# EAGLE design Mega328MLF_Programmer (EAGLE 6.6.0)
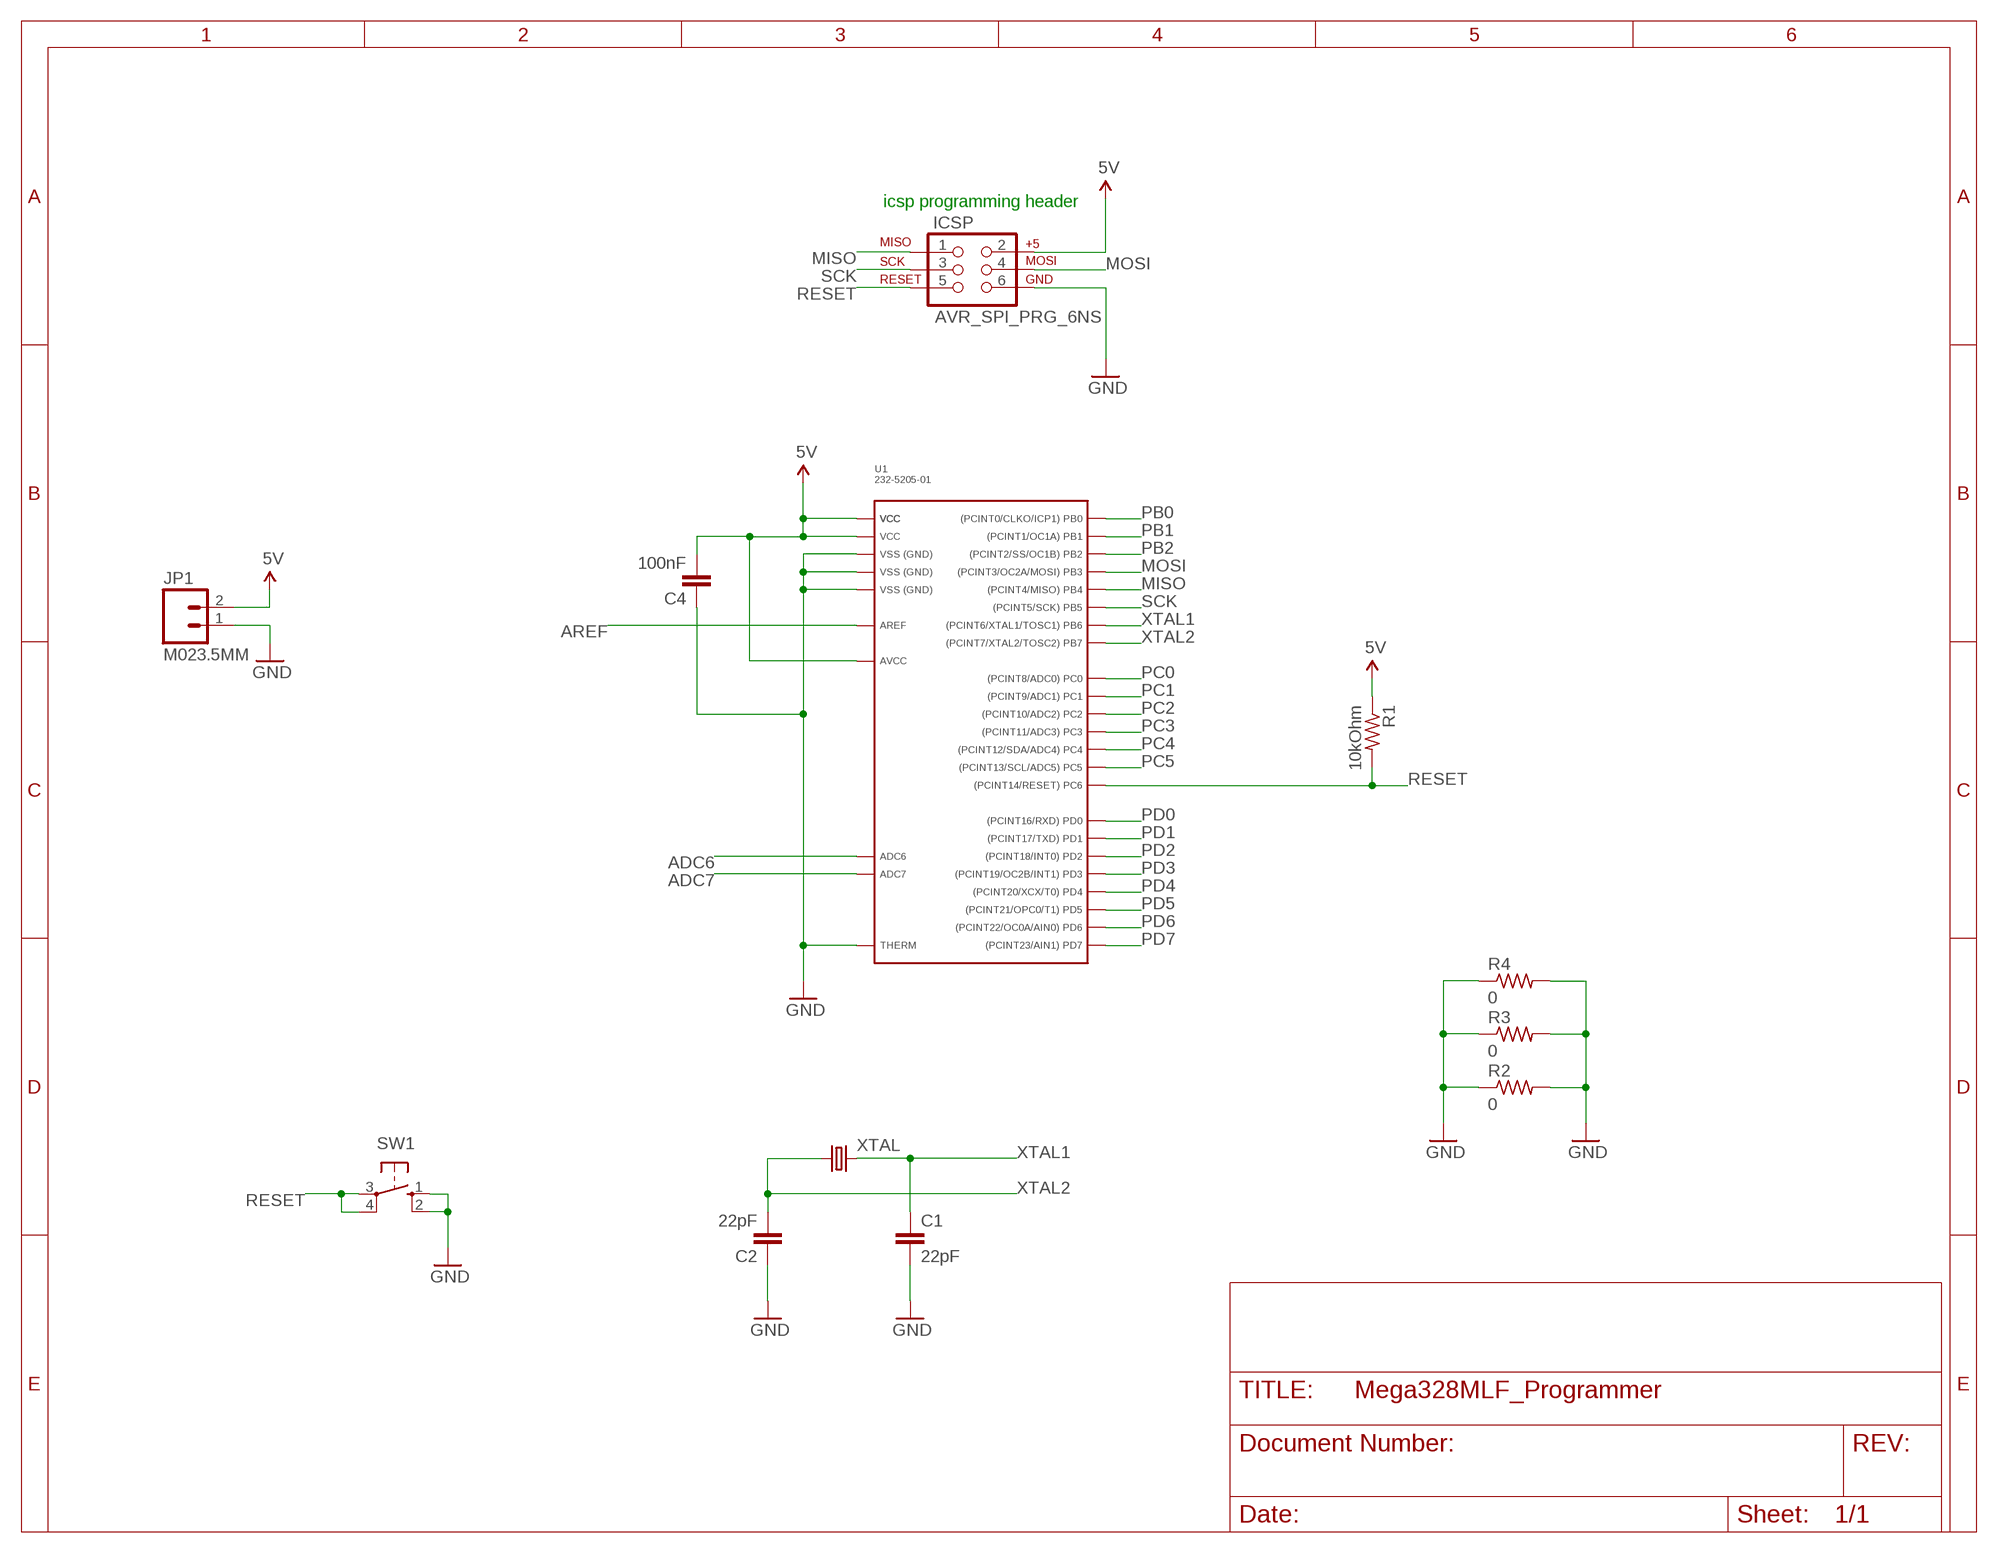
[diagram p0: schematic, sheet 1]

## Parts
C1  22pF  CAPPTH2  [CAP-PTH-SMALL2]
C2  22pF  CAPPTH2  [CAP-PTH-SMALL2]
C4  100nF  CAPPTH2  [CAP-PTH-SMALL2]
ICSP  AVR_SPI_PRG_6NS  [2X3-NS]
JP1  M023.5MM  [SCREWTERMINAL-3.5MM-2]
R1  10kOhm  R-US_0204/7  [0204/7]
R2  0  R-US_0204/7  [0204/7]
R3  0  R-US_0204/7  [0204/7]
R4  0  R-US_0204/7  [0204/7]
SW1  10-XX  [B3F-10XX]
U1  232-5205-01  [232-5205-01]
XTAL  CRYSTALHC49UV  [HC49U-V]

## Nets
5V: C4.2 ICSP.2 JP1.2 R1.1 U1.4(VCC) U1.6(VCC) U1.18(AVCC)
ADC6: U1.19(ADC6)
ADC7: U1.22(ADC7)
AREF: U1.20(AREF)
GND: C1.2 C2.1 C4.1 ICSP.6 JP1.1 R2.1 R2.2 R3.1 R3.2 R4.1 R4.2 SW1.1(S) SW1.2(S1) U1.3(GND) U1.5(GND) U1.21(GND) U1.THERM
MISO: ICSP.1 U1.16(PB4)
MOSI: ICSP.4 U1.15(PB3)
PB0: U1.12(PB0)
PB1: U1.13(PB1)
PB2: U1.14(PB2)
PC0: U1.23(PC0)
PC1: U1.24(PC1)
PC2: U1.25(PC2)
PC3: U1.26(PC3)
PC4: U1.27(PC4)
PC5: U1.28(PC5)
PD0: U1.30(PD0)
PD1: U1.31(PD1)
PD2: U1.32(PD2)
PD3: U1.1(PD3)
PD4: U1.2(PD4)
PD5: U1.9(PD5)
PD6: U1.10(PD6)
PD7: U1.11(PD7)
RESET: ICSP.5 R1.2 SW1.3(P) SW1.4(P1) U1.29(PC6)
SCK: ICSP.3 U1.17(PB5)
XTAL1: C1.1 U1.7(PB6) XTAL.2
XTAL2: C2.2 U1.8(PB7) XTAL.1

## Notes on the sheet
- icsp programming header

## Library data of the parts
C1 C2 C4 = SparkFun:CAP: Capacitor Standard 0603 ceramic capacitor, and 0.1" leaded capacitor.
ICSP = SparkFun:AVR_SPI_PRG_6: AVR ISP 6 Pin This is the reduced ISP connector for AVR programming. Common on Arduino. This footprint will take up less PCB space and can be used with a 10-pin to 6-pin adapter such as SKU: BOB-08508
JP1 = SparkFun-Connectors:M02: Standard 2-pin 0.1" header. Use with - straight break away headers ( PRT-00116) - right angle break away headers (PRT-00553) - swiss pins (PRT-00743) - machine pins (PRT-00117) - female headers (PRT-00115) Molex polarized connector foot print use with: PRT-08233 with associated crimp pins and housings. 2.54_SCREWTERM for use with PRT-10571. 3.5mm Screw Terminal footprints for PRT-08084 5mm Screw Terminal footprints for use with PRT-08432
R1-R4 = resistor:R-US_: RESISTOR, American symbol
SW1 = switch-omron:10-XX: OMRON SWITCH
U1 = wicked-device:232-5205-01
XTAL = SparkFun-FreqCtrl:CRYSTAL: Various standard crystals. Proven footprints. Spark Fun Electronics SKU : COM-00534

## Board
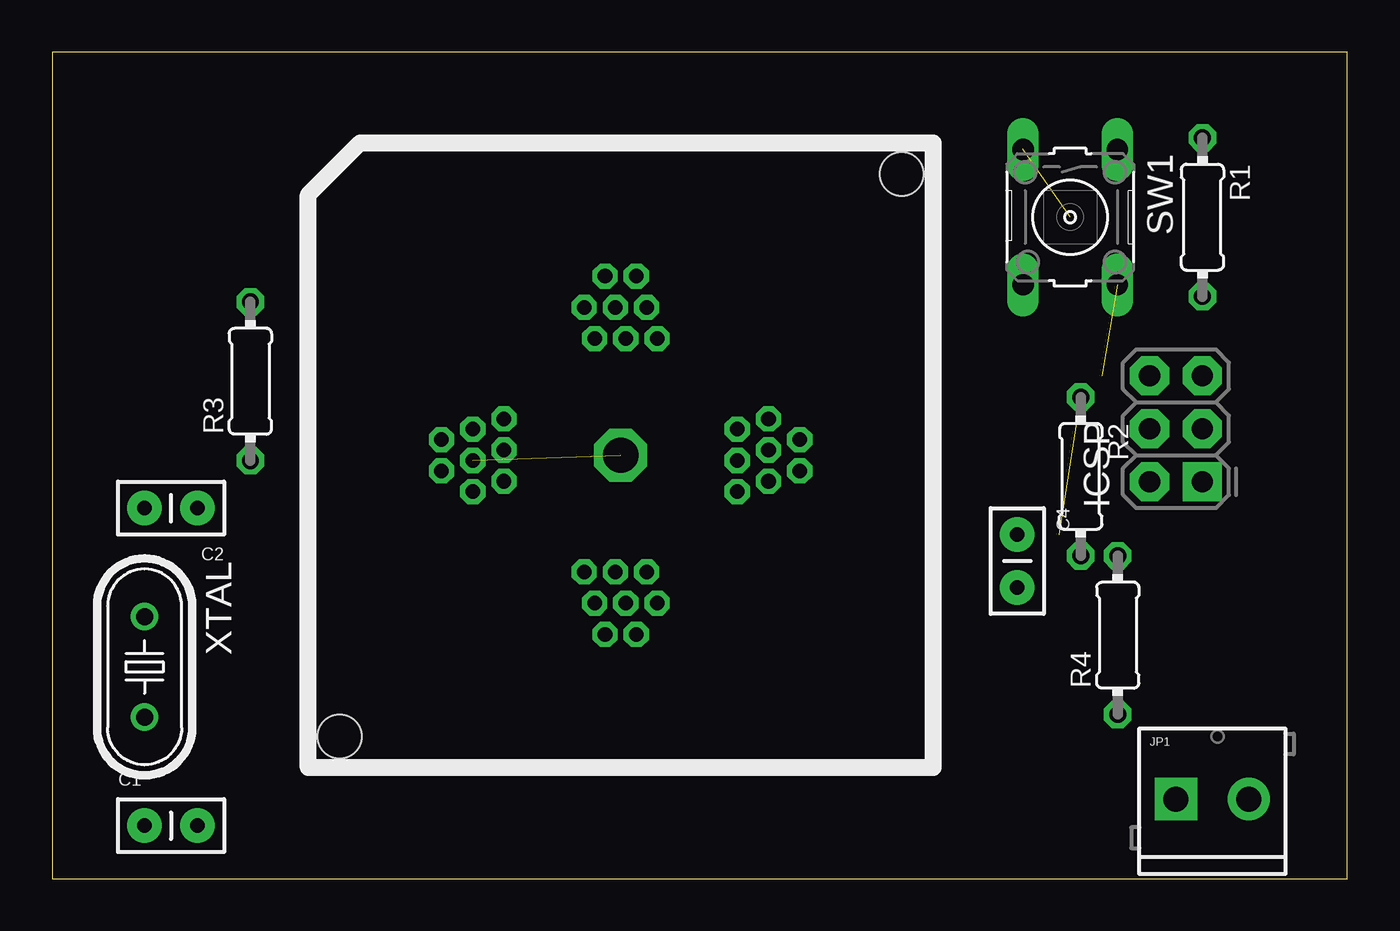
[diagram p1: board, top side]
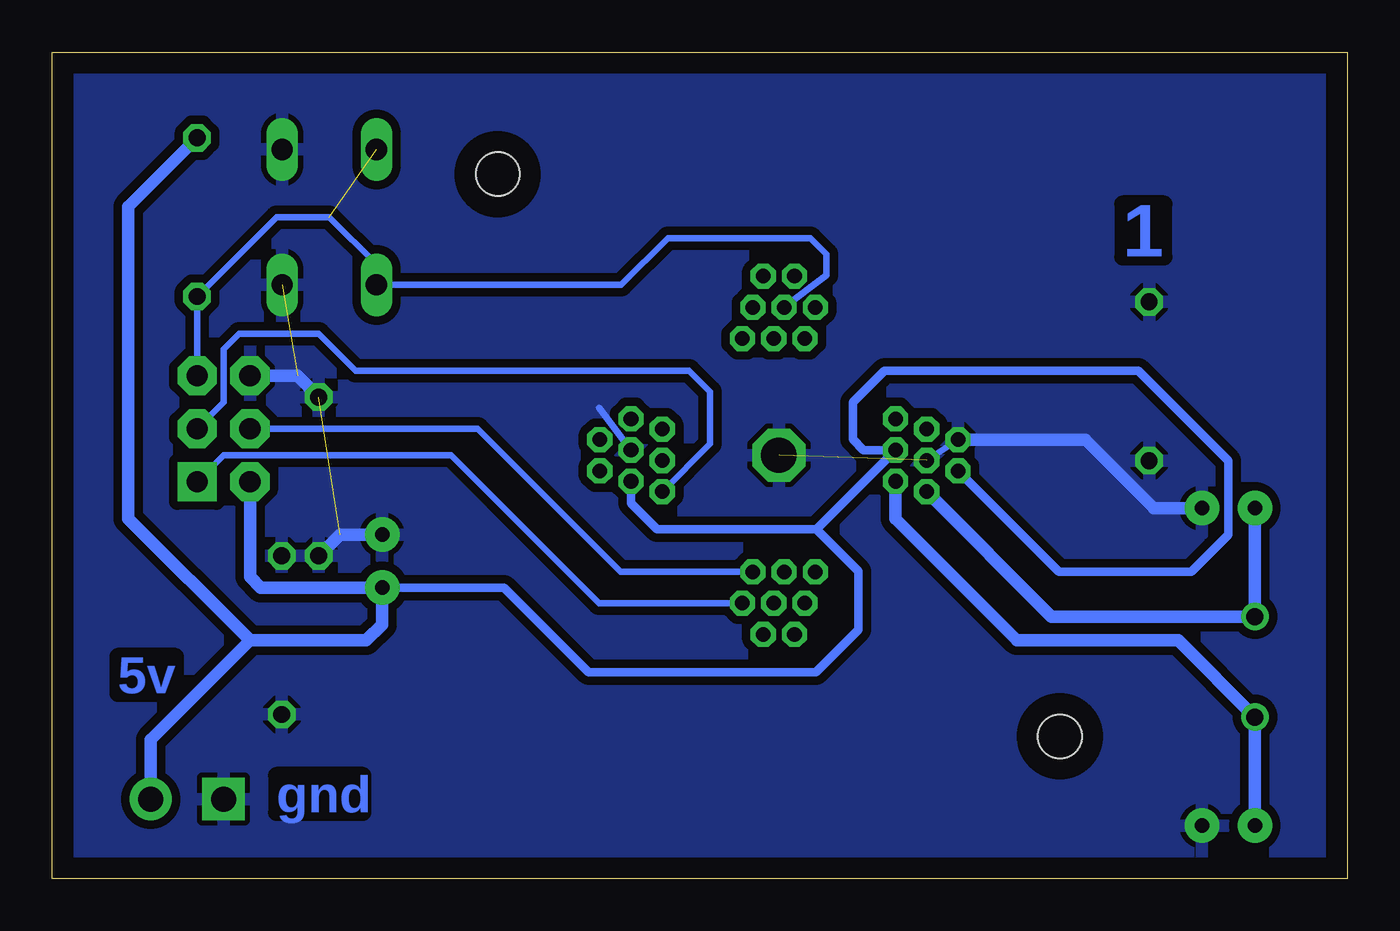
[diagram p2: board, bottom side, seen from below]

Size 62.21 x 39.67 mm. Coordinates in mm from the lower left corner, seen from the top.
Outline: 0,0 62.21,0 62.21,39.67 0,39.67 0,0
Copper layers (1*16): Top 0.035mm / dielectric 1.5mm / Bottom 0.035mm
Design rules "default": minimum track width 10mil, minimum drill 24mil, track to track 8mil, track to pad 8mil, pad to pad 8mil, via to via 8mil, smd to smd 8mil, copper to edge 40mil, drill to drill 8mil, minimum pad ring 10mil, minimum via ring 8mil, stop-mask expansion 4mil, vias tented up to drill 0mil, thermal gap 10mil

### Footprints (pad centres in the part's own frame; a part is rotated, then mirrored left to right if it is on the bottom)
CAP-PTH-SMALL2 = drill 0.7 pad 1.651: 1 0,0; 2 2.54,0
2X3-NS = drill 1.016 pad 1.88 square: 1 -2.54,-1.27 | drill 1.016 pad 1.88 octagon: 2 -2.54,1.27; 3 0,-1.27; 4 0,1.27; 5 2.54,-1.27; 6 2.54,1.27
SCREWTERMINAL-3.5MM-2 = drill 1.2 pad 2.032 square: 1 0,0 | drill 1.2 pad 2.032: 2 3.5,0
0204/7 = drill 0.813 octagon: 1 -3.81,0; 2 3.81,0
B3F-10XX = drill 1.016 long: 1 -3.251,2.261; 2 3.251,2.261; 3 -3.251,-2.261; 4 3.251,-2.261
232-5205-01 = drill 0.7 octagon: 1 -5.6,1.75; 2 -7.1,1.25; 3 -8.6,0.75; 4 -5.6,0.25; 5 -7.1,-0.25; 6 -8.6,-0.75; 7 -5.6,-1.25; 8 -7.1,-1.75; 9 -1.75,-5.6; 10 -1.25,-7.1; 11 -0.75,-8.6; 12 -0.25,-5.6; 13 0.25,-7.1; 14 0.75,-8.6; 15 1.25,-5.6; 16 1.75,-7.1; 17 5.6,-1.75; 18 7.1,-1.25; 19 8.6,-0.75; 20 5.6,-0.25; 21 7.1,0.25; 22 8.6,0.75; 23 5.6,1.25; 24 7.1,1.75; 25 1.75,5.6; 26 1.25,7.1; 27 0.75,8.6; 28 0.25,5.6; 29 -0.25,7.1; 30 -0.75,8.6; 31 -1.25,5.6; 32 -1.75,7.1 | drill 1.7 octagon: THERM 0,0 | hole 2.1: -13.5,-13.5; 13.5,13.5
HC49U-V = drill 0.813: 1 -2.413,0; 2 2.413,0

### Placement (x,y rotation side)
C1  4.45,2.54 0 top
C2  6.99,17.78 180 top
C4  46.35,16.51 270 top
ICSP  53.98,21.59 90 top
JP1  53.98,3.81 0 top
R1  55.24,31.75 270 top
R2  49.4,19.3 270 top
R3  9.53,23.88 90 top
R4  51.18,11.68 90 top
SW1  48.9,31.75 270 top
U1  27.3,20.32 0 top
XTAL  4.45,10.16 270 top

### Tracks (layer width: path | path; a pad name or v marks a point on that pad's centre or on a via)
5V
  Bottom 0.406: U1.6 13.87,14.73 7.49,14.73 5.71,16.51 5.71,20.07 10.03,24.38 22.23,24.38 23.75,22.86 23.75,21.08 23.24,20.57 U1.4 25.51,16.76 | U1.18 34.41,18.02 33.15,16.76 25.51,16.76 | C4.2 40.51,13.97 36.45,9.91 25.53,9.91 23.5,11.94 23.5,14.75 25.51,16.76
  Bottom 0.61: R1.1 58.55,32.26 58.55,17.27 52.7,11.43 | 52.7,11.43 47.12,11.43 46.35,12.19 C4.2 52.2,13.97 52.7,14.48 ICSP.2 | JP1.2 57.48,6.66 52.7,11.43
GND  (3 unrouted)
  Bottom 0.305: U1.21 35.94,22.61 | U1.5 U1.3
  Bottom 0.61: U1.3 12.59,21.07 9.29,17.78 C2.1 | C4.1 48.39,16.51 R2.2 | R2.1 50.42,24.13 ICSP.6
  pour Bottom (isolate 0.406): 0.51,41.15 66.29,41.15 66.29,-0.76 0.51,-0.76
MISO
  Bottom 0.305: U1.16 35.95,13.22 43.05,20.32 53.98,20.32 ICSP.1
MOSI
  Bottom 0.305: U1.15 34.91,14.72 41.78,21.59 ICSP.4
RESET  (1 unrouted)
  Bottom 0.305: U1.29 25.02,28.96 25.02,29.97 25.78,30.73 32.64,30.73 34.87,28.5 SW1.4 46.63,29.49 48.9,31.75 51.44,31.75 R1.2 ICSP.5
SCK
  Bottom 0.305: U1.17 30.61,20.87 30.61,23.37 31.62,24.38 47.62,24.38 49.4,26.16 53.21,26.16 53.98,25.4 53.98,22.86 ICSP.3
XTAL1
  Bottom 0.61: C1.1 XTAL.2 8.13,11.43 15.88,11.43 21.7,17.26 U1.7
XTAL2
  Bottom 0.61: C2.2 XTAL.1 14.21,12.57 U1.8

### Text on the board
Bottom: 1 | 5v | gnd